# Altium project Mini Distribution Board V0.PrjPcb
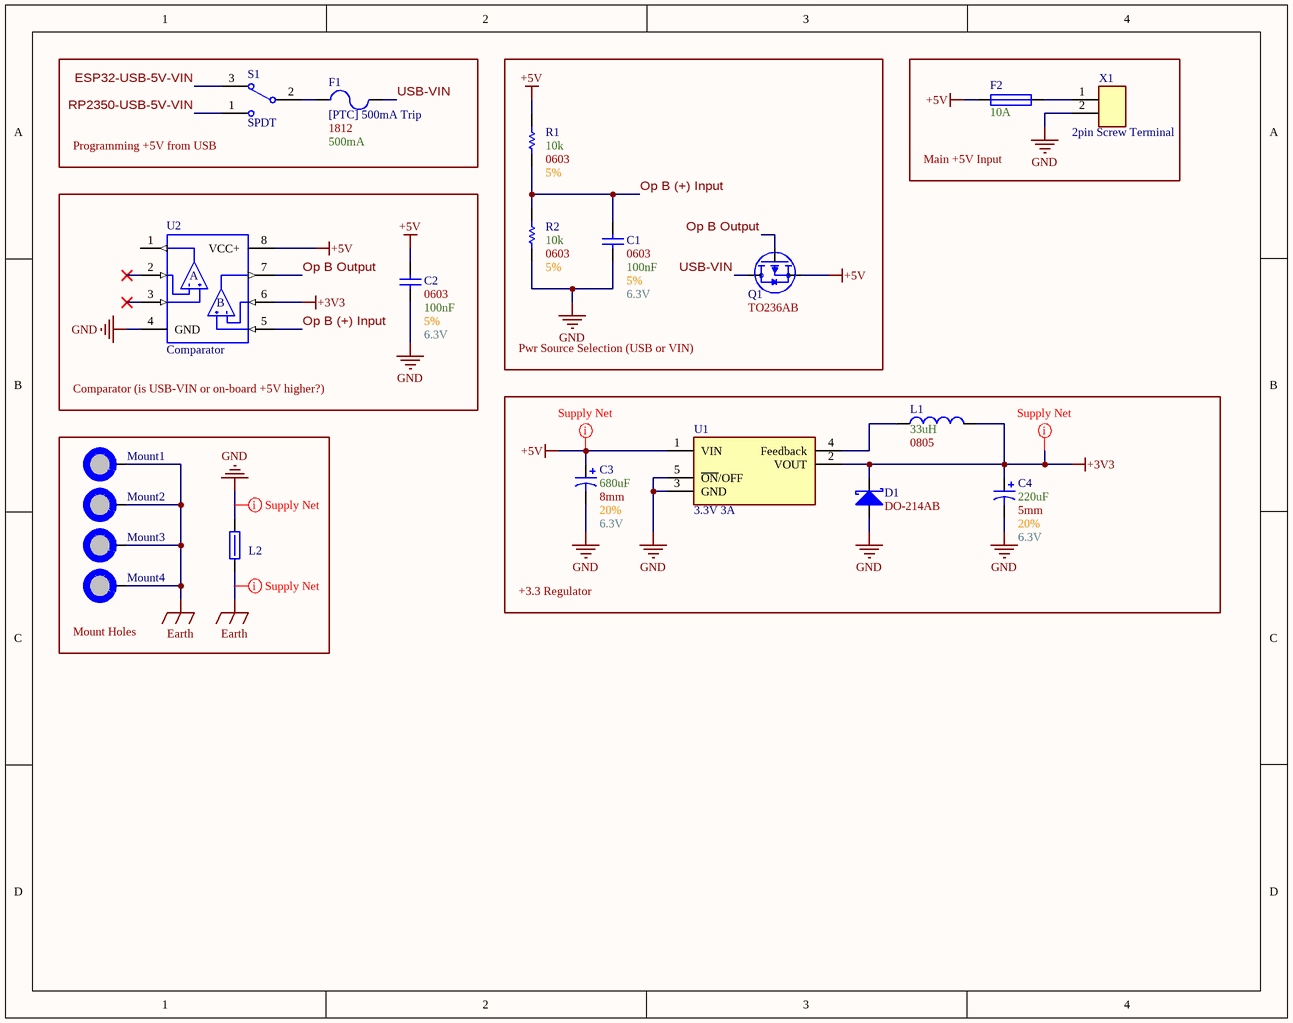
[diagram p0: Main.SchDoc]
2 sheets, 24 parts. Net scope: global (net labels, ports and power ports of the same name join across sheets).
Board file: Main.PcbDoc
Sheets:
  Main.SchDoc
  Connections.SchDoc

## Sheet Main.SchDoc
size A; SheetNumber: 1; SheetTotal: 2

### Parts
C1  Size Package: 0603  Capacitance: 100nF  Voltage: 6.3V  Tolerance: 5%  [[Cap] SMD 0603]  (hidden comment: [Cap] SMD Nonpolarized)
C2  Size Package: 0603  Capacitance: 100nF  Voltage: 6.3V  Tolerance: 5%  [[Cap] SMD 0603]  (hidden comment: [Cap] SMD Nonpolarized)
C3  Tolerance: 20%  Max Voltage: 6.3V  Capacitance: 680uF  Diameter: 8mm  [[Cap] SMD Polarized, 8mm]  (hidden comment: SMD Polarized)
C4  Tolerance: 20%  Max Voltage: 6.3V  Capacitance: 220uF  Diameter: 5mm  [[Cap] SMD Polarized, 5mm]  (hidden comment: SMD Polarized)
D1  Size Package: DO-214AB  [[Diode] SMD DO-214AB]  (hidden comment: Schottky)
F1  [PTC] 500mA Trip  Size Package: 1812  Trip Current: 500mA  [[PTC] 500mA Trip]
F2  Amperage: 10A  [[Fuse] Blade Right-Angle]  (hidden comment: Right-Angle)
L1  Size Package: 0805  Inductance: 33uH  [[Inductor] SMD 0805]  (hidden comment: SMD Inductor)
L2  652-MH2029-300Y  [[Ferrite] SMD Bead 0805 (1)]  (value not drawn)
Mount1  M3 Mount Hole  [[Mount] M3 Mount Hole]  (value not drawn)  (no BOM)
Mount2  M3 Mount Hole  [[Mount] M3 Mount Hole]  (value not drawn)  (no BOM)
Mount3  M3 Mount Hole  [[Mount] M3 Mount Hole]  (value not drawn)  (no BOM)
Mount4  M3 Mount Hole  [[Mount] M3 Mount Hole]  (value not drawn)  (no BOM)
Q1  Size Package: TO236AB  [[FET] P-Channel Mosfet]  (hidden comment: PMV48XP)
R1  Resistance: 10k  Size Package: 0603  Tolerance: 5%  [[Res] SMD 0603]  (hidden comment: [Res] SMD Resistor)
R2  Resistance: 10k  Size Package: 0603  Tolerance: 5%  [[Res] SMD 0603]  (hidden comment: [Res] SMD Resistor)
S1  SPDT  [[Switch] SPDT]
U1  3.3V 3A  [[Reg] 3V3 Regulator (4)]
U2  Comparator  [[IC] Dual Op-Ap]
X1  2pin Screw Terminal  [[Screw Terminal] 2pin 5mm]

### Blocks framed on the sheet
Programming +5V from USB: F1 S1
Pwr Source Selection (USB or VIN): C1 Q1 R1 R2
Main +5V Input: F2 X1
Comparator (is USB-VIN or on-board +5V higher?): C2 U2
+3.3 Regulator: C3 C4 D1 L1 U1
Mount Holes: L2 Mount1-Mount4

### Nets
+3V3: C4.1 D1.1(K) L1.2 U1.2(VOUT) U2.6(2IN-)
+5V: C2.2 C3.1 F2.1 Q1.2(S) R1.2 U1.1(VIN) U2.8(VCC+)
Earth: L2.1 Mount1.1 Mount2.1 Mount3.1 Mount4.1
GND: C1.1 C2.1 C3.2 C4.2 D1.2(A) L2.2 R2.1 U1.3(GND) U1.5(~{ON}/OFF) U2.4(GND) X1.2
ESP32-USB-5V-VIN: S1.3
Op B (+) Input: C1.2 R1.1 R2.2 U2.5(2IN+)
Op B Output: Q1.1(G) U2.7(2OUT)
RP2350-USB-5V-VIN: S1.1
USB-VIN: F1.2 Q1.3(D)
NetF1_1: F1.1 S1.2
NetF2_2: F2.2 X1.1
NetL1_1: L1.1 U1.4(Feedback)

Not connected (* = marked no-connect by the designer): U2 1(1OUT) 2(1IN-)* 3(1IN+)*

### Layout directives
net class Supply_Nets: +3V3, +5V, Earth, GND

### Notes on the sheet
- (in symbol [IC] Dual Op-Amp) A; B

### Library data of the parts
C3 C4 = [Cap] SMD Polarized: Supplier 1: DigiKey
  C3: Supplier Part Number 1: PCE3781CT-ND
  C4: Supplier Part Number 1: 493-17593-1-ND
D1 = [Diode] SMD Schottky: Generic; Supplier 1: DigiKey; Supplier Part Number 1: B530C-FDICT-ND
F1 = [PTC] 500mA Trip: MF-MSMF050-2; Supplier 1: DigiKey; Supplier Part Number 1: MF-MSMF050-2DKR-ND
F2 = [Fuse] Blade Right-Angle: Supplier 1: DigiKey; Supplier Part Number 1: 36-3549-2-ND
L1 = [Inductor] SMD Inductor: JLC Part #: *; Mouser Part #: *; Supplier 1: DigiKey; Supplier Part Number 1: 445-6399-1-ND
L2 = [Ferrite] SMD Ferrite Bead (1): Res @ Freq: 30 @ 100MHz; Size Package: 0805
Mount1-Mount4 = [Mount] M3 Mount Hole: Place at least 4.5mm from board edge. Plated.
Q1 = [FET] P-Channel MOSFET: Supplier 1: DigiKey; Supplier Part Number 1: 1727-PMV48XPA2RCT-ND
R1 R2 = [Res] SMD Resistor: Generic; Supplier 1: DigiKey; Supplier Part Number 1: 311-10.0KHRDKR-ND
S1 = [Switch] SPDT Switch: Supplier 1: DigiKey; Supplier Part Number 1: 1948-1087-ND
U1 = [Reg] 3V3 Regulator (4): 3A; Supplier 1: DigiKey; Supplier Part Number 1: LM2596SX-3.3/NOPBCT-ND
U2 = [IC] Dual Op-Amp: LMV358IDGKR; Supplier 1: DigiKey; Supplier Part Number 1: 296-13455-1-ND
X1 = [Screw Terminal] 2pin: Supplier 1: DigiKey; Supplier Part Number 1: 102-6145-ND
C1 C2 = [Cap] SMD Nonpolarized: Supplier 1: DigiKey; Supplier Part Number 1: 311-1088-6-ND

## Sheet Connections.SchDoc
size A; SheetNumber: 2; SheetTotal: 2
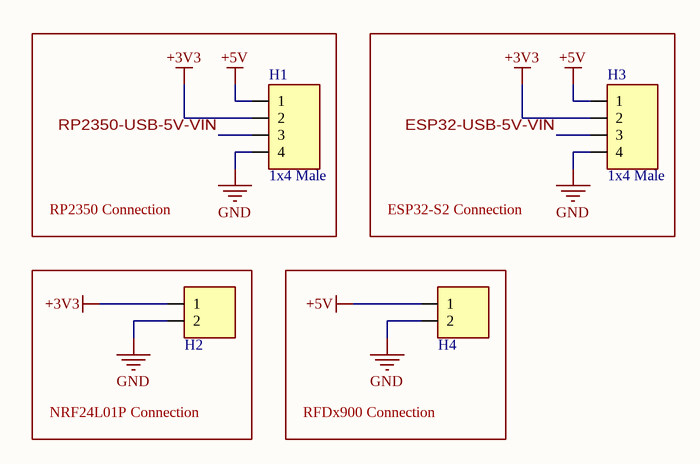
[diagram p1: Connections.SchDoc]

### Parts
H1  1x4 Male  [[Header] Shrouded 1x4 Male]
H2  1x2 Male  [[Header] Shrouded 1x2 Male]  (value not drawn)
H3  1x4 Male  [[Header] Shrouded 1x4 Male]
H4  1x2 Male  [[Header] Shrouded 1x2 Male]  (value not drawn)

### Blocks framed on the sheet
RP2350 Connection: H1
ESP32-S2 Connection: H3
NRF24L01P Connection: H2
RFDx900 Connection: H4

### Nets
+3V3: H1.2 H2.1 H3.2
+5V: H1.1 H3.1 H4.1
GND: H1.4 H2.2 H3.4 H4.2
ESP32-USB-5V-VIN: H3.3
RP2350-USB-5V-VIN: H1.3

### Library data of the parts
H1 H3 = [Header] Shrouded 1x4 Male: 70543-0003 / Mates with 005057-9404; Supplier 1: Avnet; Supplier Part Number 1: 0705430003
H2 H4 = [Header] Shrouded 1x2 Male: 0705430036 / Mates with 0050579402; Supplier 1: DigiKey; Supplier 2: DigiKey; Supplier Part Number 2: WM2900-ND; Supplier Part Number 1: WM4824-ND

## Nets that join several sheets
+3V3: Main (5 pins), Connections (H1.2 H2.1 H3.2)
+5V: Main (7 pins), Connections (H1.1 H3.1 H4.1)
GND: Main (11 pins), Connections (H1.4 H2.2 H3.4 H4.2)
ESP32-USB-5V-VIN: Main (S1.3), Connections (H3.3)
RP2350-USB-5V-VIN: Main (S1.1), Connections (H1.3)